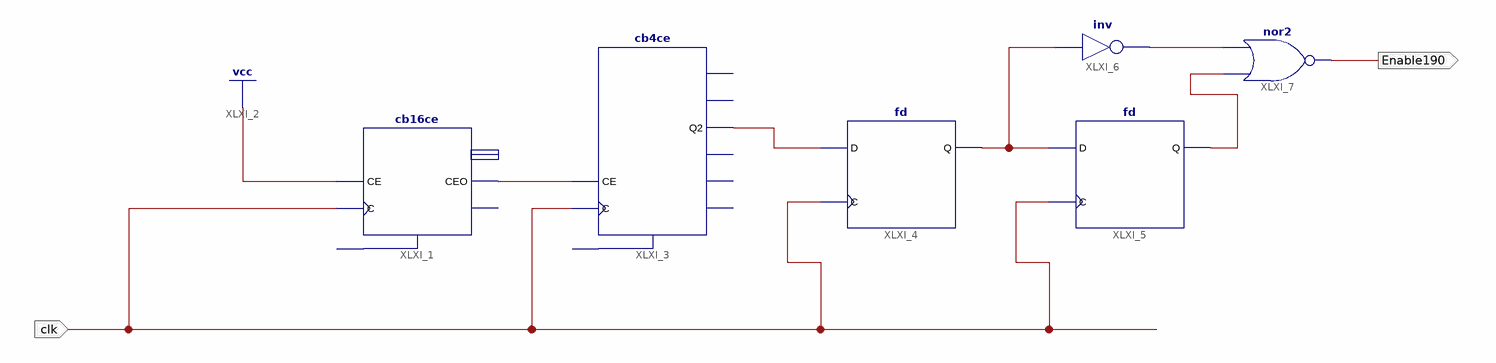
[diagram p0: schematic sheet 1]
// Xilinx ISE schematic enable190.sch (spartan6) as structural Verilog: 6 symbols, 2 ports
module enable190 (
  input  clk,
  output Enable190
);

  wire clk190, XLXN_6, XLXN_12, XLXN_13, XLXN_14;

  cb16ce XLXI_1 (.C(clk), .CE(1'b1), .CEO(XLXN_6));  // open: CLR, Q, TC
  cb4ce XLXI_3 (.C(clk), .CE(XLXN_6), .Q2(clk190));  // open: CLR, CEO, Q0, Q1, Q3, TC
  fd XLXI_4 (.C(clk), .D(clk190), .Q(XLXN_12));
  fd XLXI_5 (.C(clk), .D(XLXN_12), .Q(XLXN_14));
  not XLXI_6 (XLXN_13, XLXN_12);
  nor XLXI_7 (Enable190, XLXN_14, XLXN_13);
endmodule
